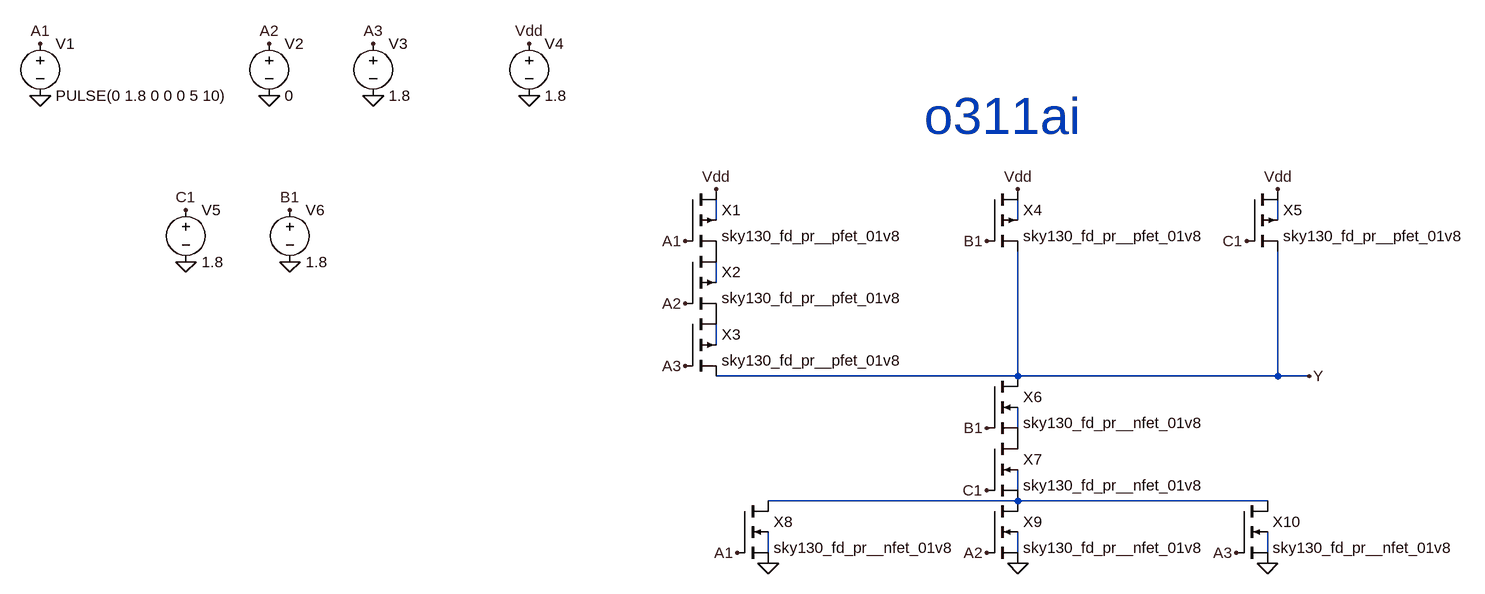
[diagram p0: schematic o311ai.asc]
o311ai.asc, the LTspice schematic file:
Version 4
SHEET 1 2256 1228
WIRE 368 128 368 96
WIRE 832 128 832 96
WIRE 1232 128 1232 96
WIRE 368 224 368 192
WIRE 368 320 368 288
WIRE 832 368 832 176
WIRE 832 368 368 368
WIRE 1232 368 1232 176
WIRE 1232 368 832 368
WIRE 1280 368 1232 368
WIRE 832 448 832 416
WIRE 832 544 832 512
WIRE 832 560 448 560
WIRE 1216 560 832 560
WIRE 448 640 448 608
WIRE 832 640 832 608
WIRE 1216 640 1216 608
FLAG 368 80 Vdd
FLAG -672 -64 0
FLAG -320 -64 0
FLAG -160 -64 0
FLAG -672 -144 A1
FLAG -320 -144 A2
FLAG -160 -144 A3
FLAG 80 -144 Vdd
FLAG 80 -64 0
FLAG -448 192 0
FLAG -448 112 C1
FLAG -288 192 0
FLAG -288 112 B1
FLAG 320 160 A1
FLAG 320 256 A2
FLAG 320 352 A3
FLAG 784 448 B1
FLAG 784 544 C1
FLAG 448 656 0
FLAG 832 656 0
FLAG 1216 656 0
FLAG 400 640 A1
FLAG 784 640 A2
FLAG 1168 640 A3
FLAG 784 160 B1
FLAG 1184 160 C1
FLAG 832 80 Vdd
FLAG 1232 80 Vdd
FLAG 1280 368 Y
SYMBOL pmos4 320 80 R0
SYMATTR InstName X1
SYMATTR Value2 l=0.13u w=4u
SYMATTR Value sky130_fd_pr__pfet_01v8
SYMBOL pmos4 320 176 R0
SYMATTR InstName X2
SYMATTR Value2 l=0.13u w=4u
SYMATTR Value sky130_fd_pr__pfet_01v8
SYMBOL pmos4 320 272 R0
SYMATTR InstName X3
SYMATTR Value2 l=0.13u w=4u
SYMATTR Value sky130_fd_pr__pfet_01v8
SYMBOL pmos4 784 80 R0
SYMATTR InstName X4
SYMATTR Value2 l=0.13u w=4u
SYMATTR Value sky130_fd_pr__pfet_01v8
SYMBOL voltage -672 -160 R0
WINDOW 123 0 0 Left 0
WINDOW 39 0 0 Left 0
SYMATTR InstName V1
SYMATTR Value PULSE(0 1.8 0 0 0 5 10)
SYMBOL voltage -320 -160 R0
WINDOW 123 0 0 Left 0
WINDOW 39 0 0 Left 0
SYMATTR InstName V2
SYMATTR Value 0
SYMBOL voltage -160 -160 R0
WINDOW 123 0 0 Left 0
WINDOW 39 0 0 Left 0
SYMATTR InstName V3
SYMATTR Value 1.8
SYMBOL voltage 80 -160 R0
WINDOW 123 0 0 Left 0
WINDOW 39 0 0 Left 0
SYMATTR InstName V4
SYMATTR Value 1.8
SYMBOL voltage -448 96 R0
WINDOW 123 0 0 Left 0
WINDOW 39 0 0 Left 0
SYMATTR InstName V5
SYMATTR Value 1.8
SYMBOL voltage -288 96 R0
WINDOW 123 0 0 Left 0
WINDOW 39 0 0 Left 0
SYMATTR InstName V6
SYMATTR Value 1.8
SYMBOL nmos4 784 368 R0
SYMATTR InstName X6
SYMATTR Value2 l=0.13u w=2u
SYMATTR Value sky130_fd_pr__nfet_01v8
SYMBOL nmos4 784 464 R0
SYMATTR InstName X7
SYMATTR Value2 l=0.13u w=2u
SYMATTR Value sky130_fd_pr__nfet_01v8
SYMBOL nmos4 400 560 R0
SYMATTR InstName X8
SYMATTR Value2 l=0.13u w=2u
SYMATTR Value sky130_fd_pr__nfet_01v8
SYMBOL nmos4 784 560 R0
SYMATTR InstName X9
SYMATTR Value2 l=0.13u w=2u
SYMATTR Value sky130_fd_pr__nfet_01v8
SYMBOL nmos4 1168 560 R0
SYMATTR InstName X10
SYMATTR Value2 l=0.13u w=2u
SYMATTR Value sky130_fd_pr__nfet_01v8
SYMBOL pmos4 1184 80 R0
SYMATTR InstName X5
SYMATTR Value2 l=0.13u w=4u
SYMATTR Value sky130_fd_pr__pfet_01v8
TEXT 688 -32 Left 6 ;o311ai

The netlist it stands for:
* o311ai.asc
M§X1 Vdd A1 P001 N001 sky130_fd_pr__pfet_01v8 l=0.13u w=4u
M§X2 P001 A2 P002 N004 sky130_fd_pr__pfet_01v8 l=0.13u w=4u
M§X3 P002 A3 Y N005 sky130_fd_pr__pfet_01v8 l=0.13u w=4u
M§X4 Vdd B1 Y N002 sky130_fd_pr__pfet_01v8 l=0.13u w=4u
V1 A1 0 PULSE(0 1.8 0 0 0 5 10)
V2 A2 0 0
V3 A3 0 1.8
V4 Vdd 0 1.8
V5 C1 0 1.8
V6 B1 0 1.8
M§X6 Y B1 P003 N006 sky130_fd_pr__nfet_01v8 l=0.13u w=2u
M§X7 P003 C1 N008 N007 sky130_fd_pr__nfet_01v8 l=0.13u w=2u
M§X8 N008 A1 0 N009 sky130_fd_pr__nfet_01v8 l=0.13u w=2u
M§X9 N008 A2 0 N010 sky130_fd_pr__nfet_01v8 l=0.13u w=2u
M§X10 N008 A3 0 N011 sky130_fd_pr__nfet_01v8 l=0.13u w=2u
M§X5 Vdd C1 Y N003 sky130_fd_pr__pfet_01v8 l=0.13u w=4u
.model NMOS NMOS
.model PMOS PMOS
.lib standard.mos
* o311ai
.backanno
.end